# EAGLE design isolation (EAGLE 9.6.2)
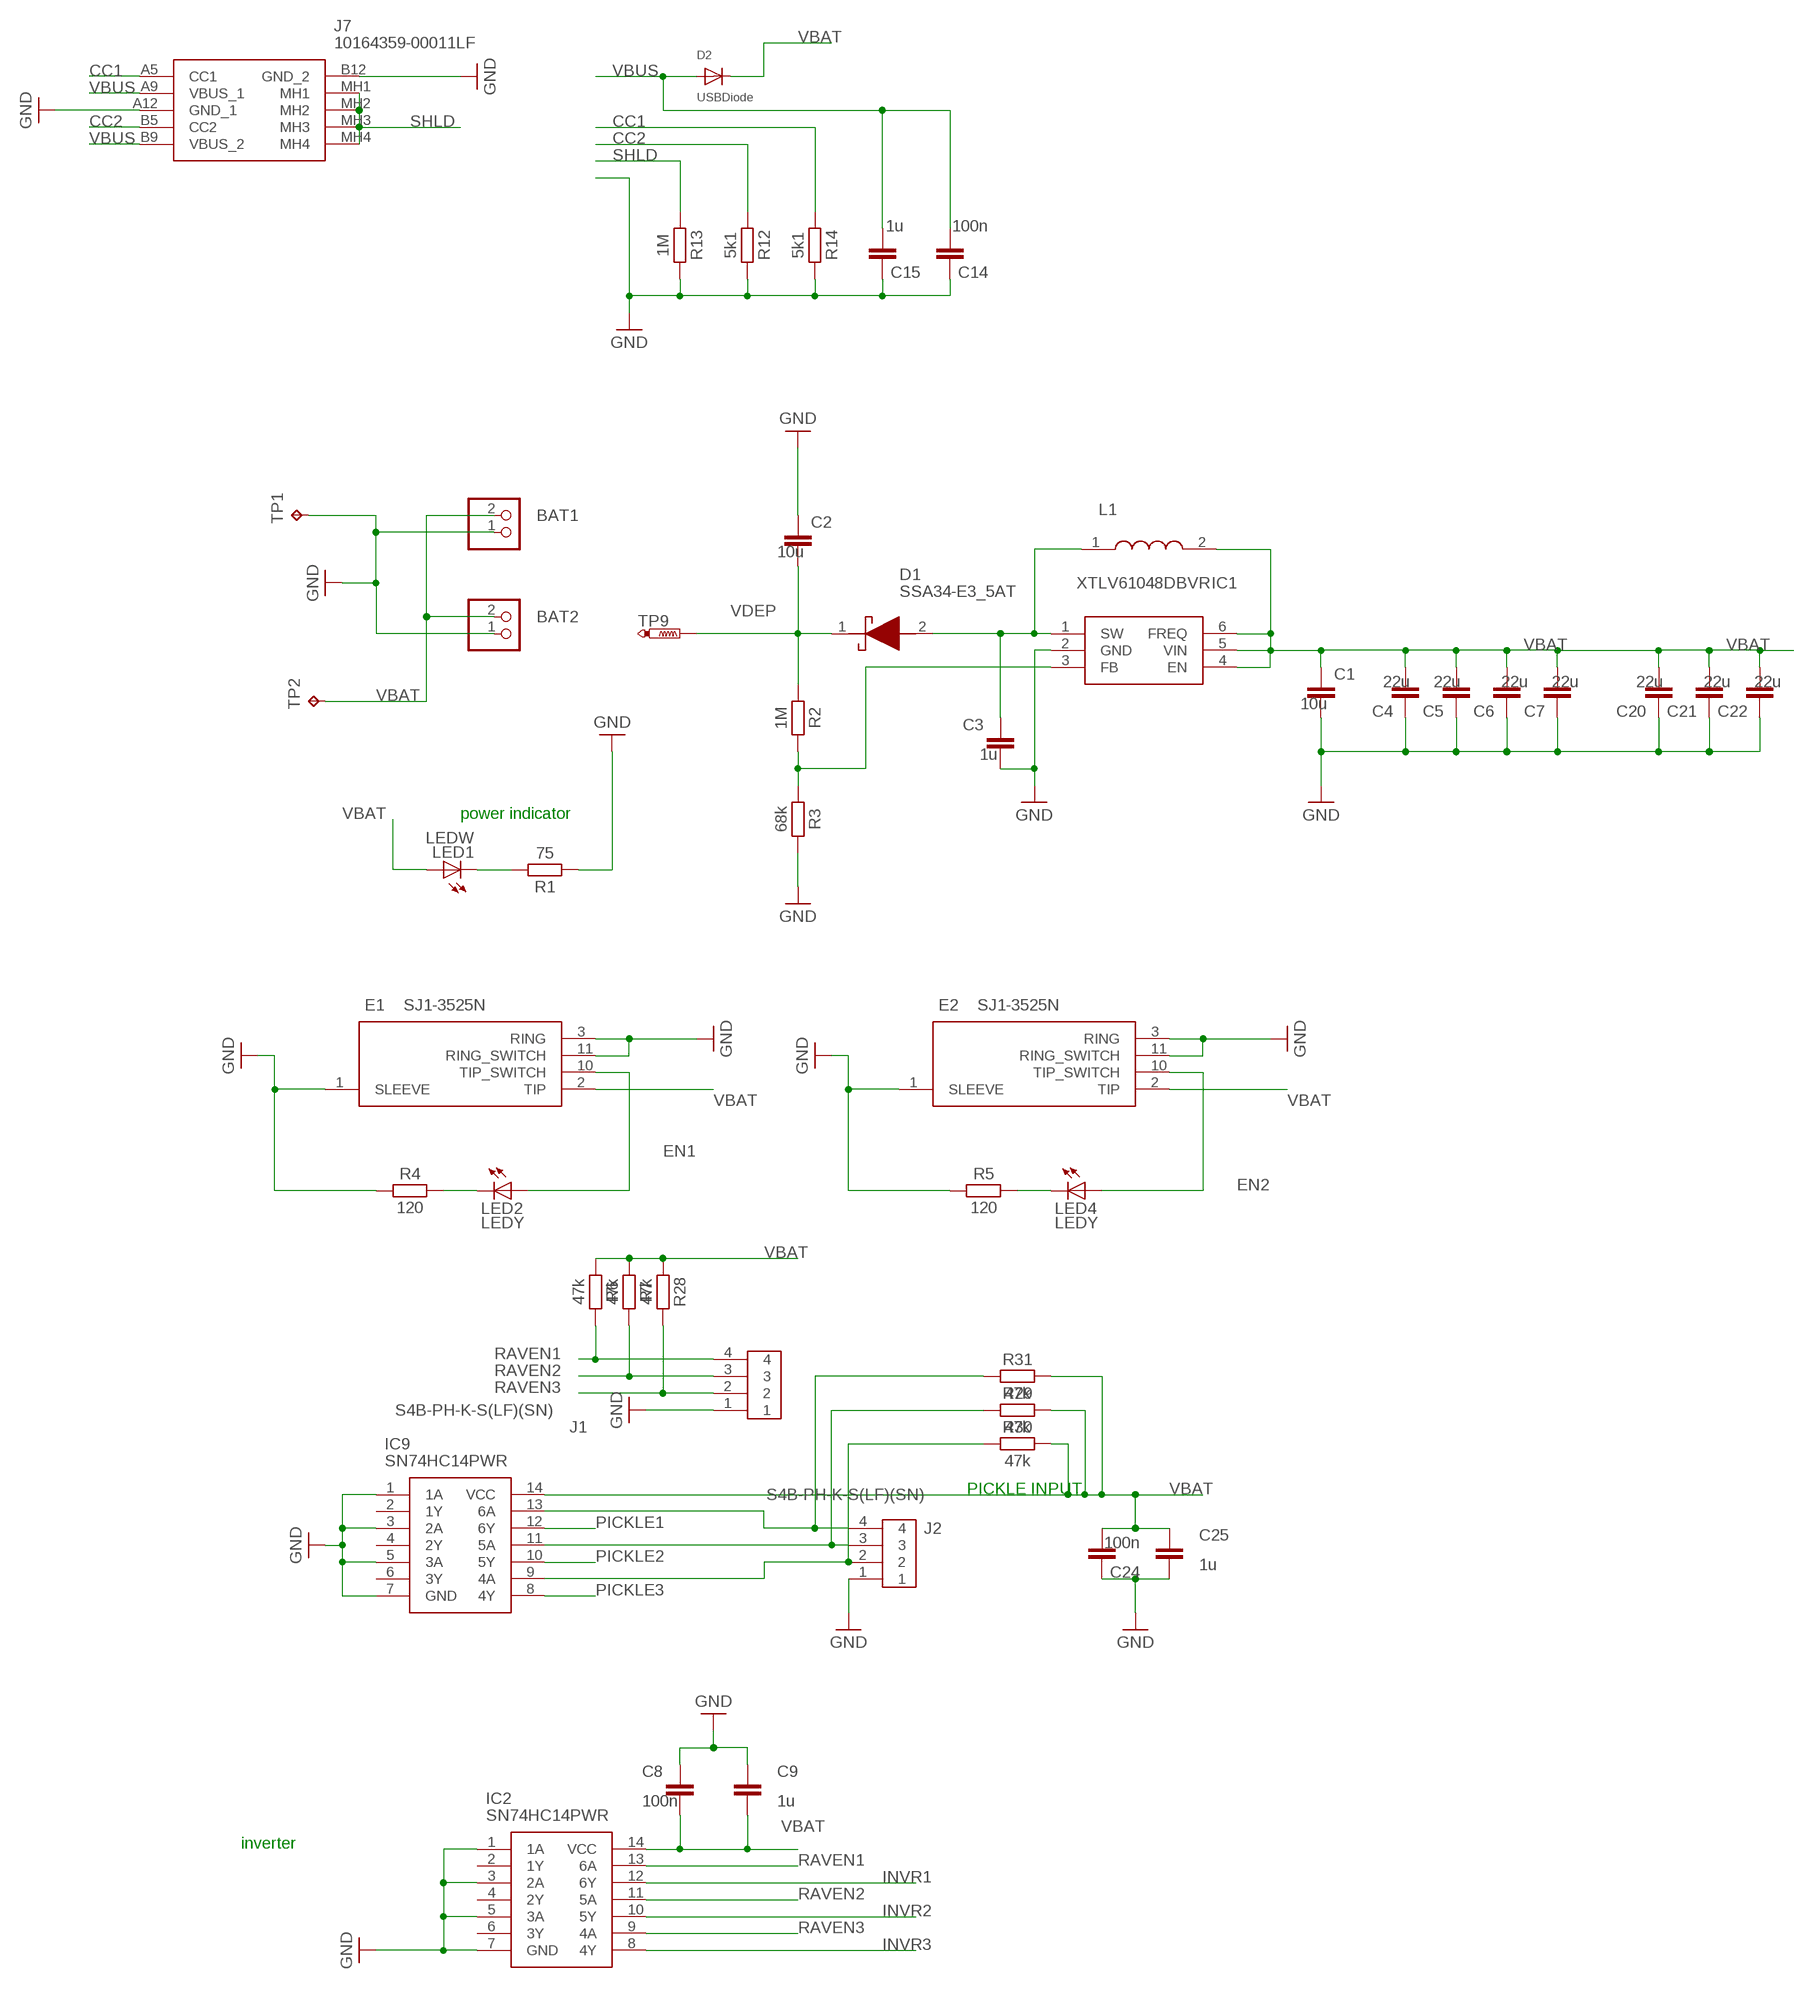
[diagram p0: schematic, sheet 1, part 1 of 2]
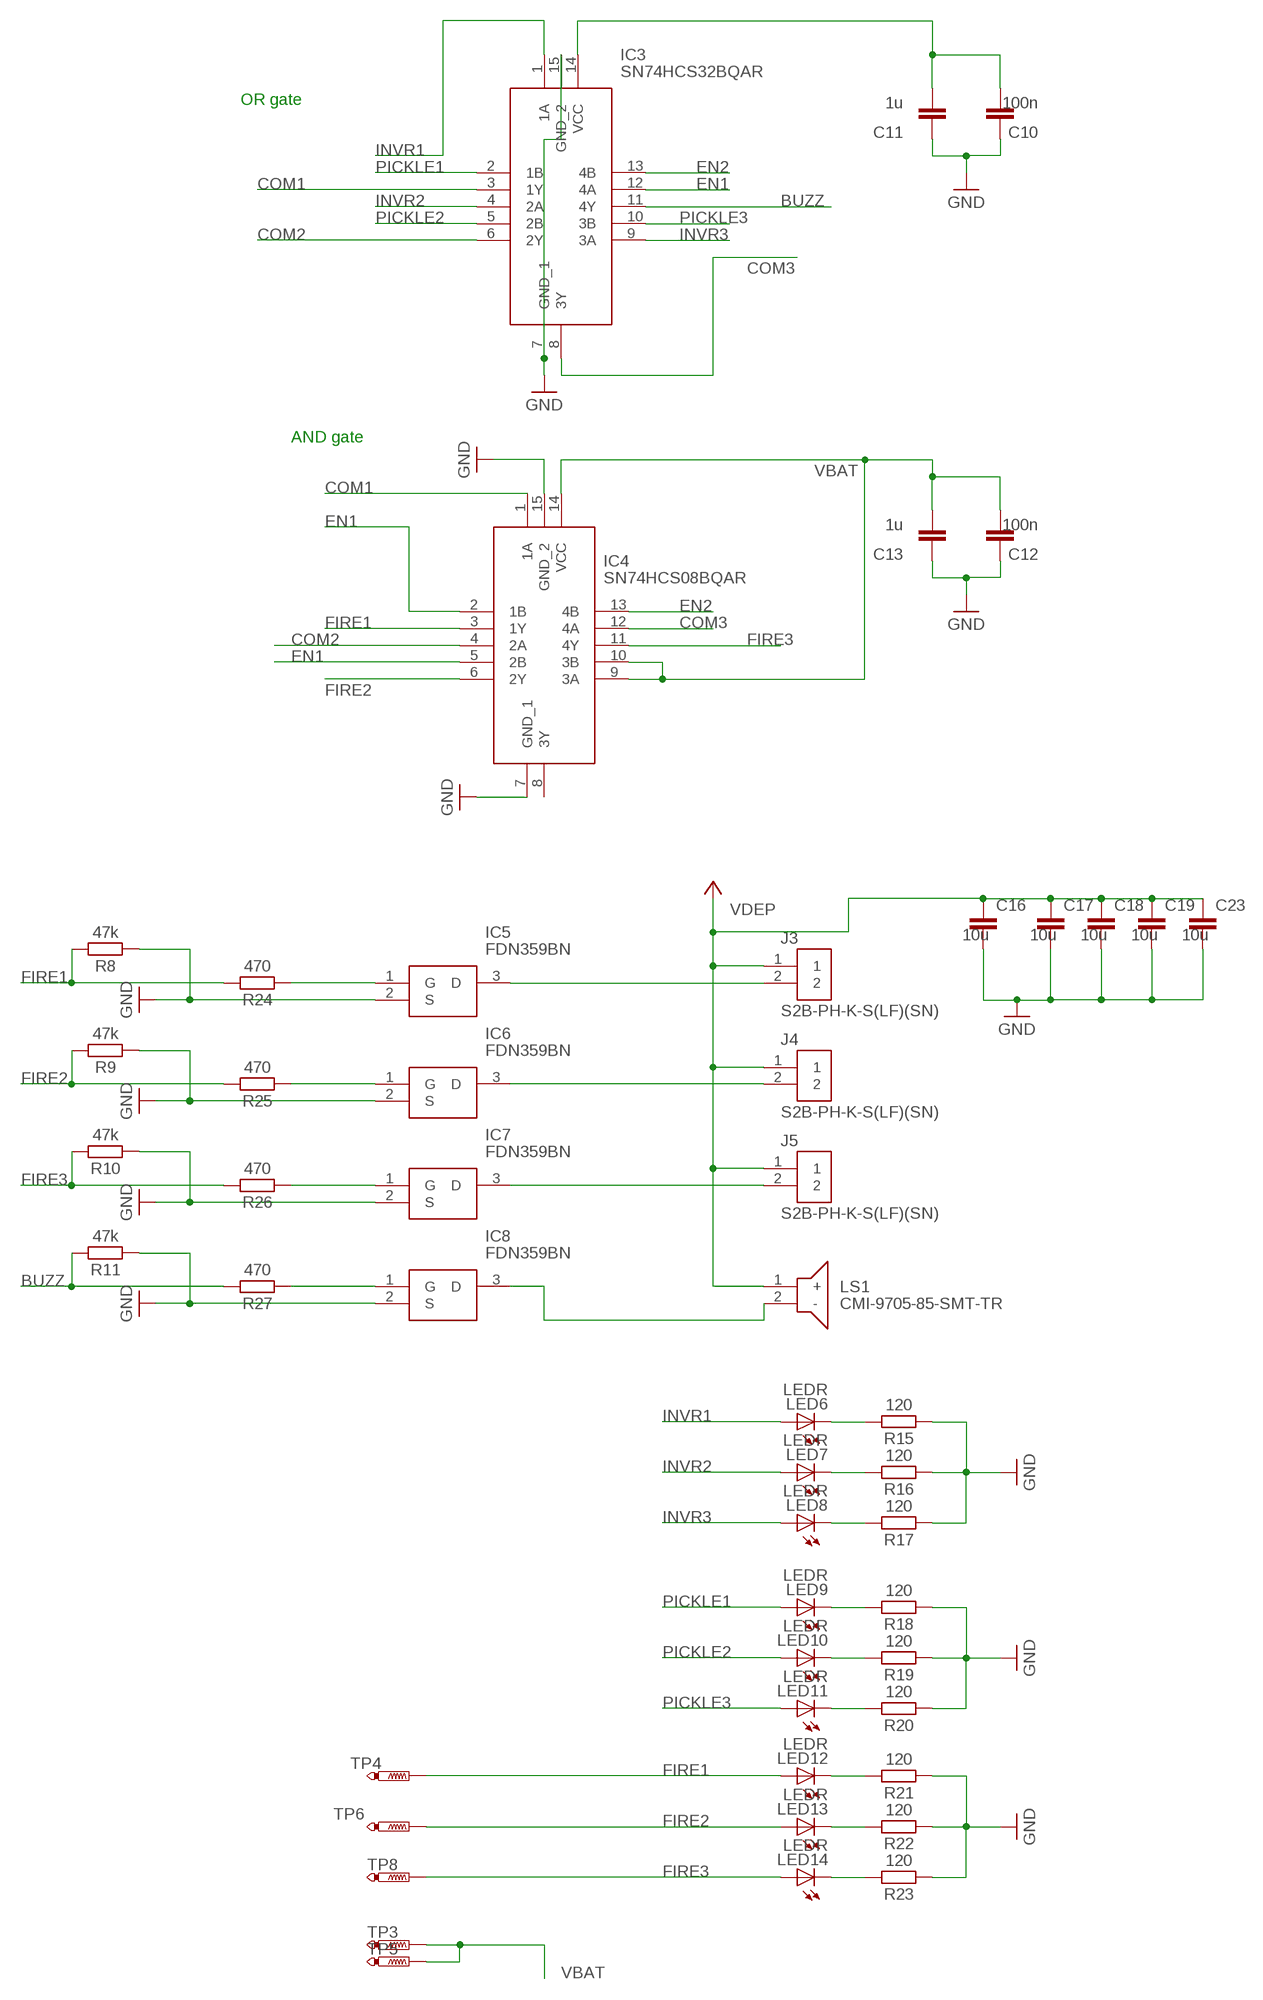
[diagram p1: schematic, sheet 1, part 2 of 2]

## Parts
BAT1  JST_2PIN-THM-RA  [JST-PH-2-THM-RA]
BAT2  JST_2PIN-THM-RA  [JST-PH-2-THM-RA]
C1  10u  C_CHIP-0402(1005-METRIC)  [CAPC1005X60]
C2  10u  C_CHIP-0603(1608-METRIC)  [CAPC1608X85]
C3  1u  C_CHIP-0402(1005-METRIC)  [CAPC1005X60]
C4  22u  C_CHIP-0603(1608-METRIC)  [CAPC1608X85]
C5  22u  C_CHIP-0603(1608-METRIC)  [CAPC1608X85]
C6  22u  C_CHIP-0603(1608-METRIC)  [CAPC1608X85]
C7  22u  C_CHIP-0603(1608-METRIC)  [CAPC1608X85]
C8  100n  C_CHIP-0402(1005-METRIC)  [CAPC1005X60]
C9  1u  C_CHIP-0402(1005-METRIC)  [CAPC1005X60]
C10  100n  C_CHIP-0402(1005-METRIC)  [CAPC1005X60]
C11  1u  C_CHIP-0402(1005-METRIC)  [CAPC1005X60]
C12  100n  C_CHIP-0402(1005-METRIC)  [CAPC1005X60]
C13  1u  C_CHIP-0402(1005-METRIC)  [CAPC1005X60]
C14  100n  C_CHIP-0402(1005-METRIC)  [CAPC1005X60]
C15  1u  C_CHIP-0402(1005-METRIC)  [CAPC1005X60]
C16  10u  C_CHIP-0603(1608-METRIC)  [CAPC1608X85]
C17  10u  C_CHIP-0603(1608-METRIC)  [CAPC1608X85]
C18  10u  C_CHIP-0603(1608-METRIC)  [CAPC1608X85]
C19  10u  C_CHIP-0603(1608-METRIC)  [CAPC1608X85]
C20  22u  C_CHIP-0603(1608-METRIC)  [CAPC1608X85]
C21  22u  C_CHIP-0603(1608-METRIC)  [CAPC1608X85]
C22  22u  C_CHIP-0603(1608-METRIC)  [CAPC1608X85]
C23  10u  C_CHIP-0603(1608-METRIC)  [CAPC1608X85]
C24  100n  C_CHIP-0402(1005-METRIC)  [CAPC1005X60]
C25  1u  C_CHIP-0402(1005-METRIC)  [CAPC1005X60]
D1  SSA34-E3_5AT  [DIOM5127X229N]
D2  USBDiode  DIODE_SOD-123FL  [SOD-123FL]
E1  SJ1-3525N  [SJ13525N]
E2  SJ1-3525N  [SJ13525N]
IC1  XTLV61048DBVR  [SOT95P280X145-6N]
IC2  SN74HC14PWR  [SOP65P640X120-14N]
IC3  SN74HCS32BQAR  [SN74HCS32BQAR]
IC4  SN74HCS08BQAR  [SN74HCS08BQAR]
IC5  FDN359BN  [SOT95P251X112-3N]
IC6  FDN359BN  [SOT95P251X112-3N]
IC7  FDN359BN  [SOT95P251X112-3N]
IC8  FDN359BN  [SOT95P251X112-3N]
IC9  SN74HC14PWR  [SOP65P640X120-14N]
J1  S4B-PH-K-S(LF)(SN)  [S4B-PH-K-S(LF)(SN)]
J2  S4B-PH-K-S(LF)(SN)  [S4B-PH-K-S(LF)(SN)]
J3  S2B-PH-K-S(LF)(SN)  [S2B-PH-K-S(LF)(SN)]
J4  S2B-PH-K-S(LF)(SN)  [S2B-PH-K-S(LF)(SN)]
J5  S2B-PH-K-S(LF)(SN)  [S2B-PH-K-S(LF)(SN)]
J7  10164359-00011LF  [1016435900011LF]
L1  10μH  BMRF00060630100MA1  [BMRF00060630100MA1]
LED1  LEDW  LEDCHIPLED_0805  [CHIPLED_0805]
LED2  LEDY  LEDCHIPLED_0805  [CHIPLED_0805]
LED4  LEDY  LEDCHIPLED_0805  [CHIPLED_0805]
LED6  LEDR  LEDCHIPLED_0805  [CHIPLED_0805]
LED7  LEDR  LEDCHIPLED_0805  [CHIPLED_0805]
LED8  LEDR  LEDCHIPLED_0805  [CHIPLED_0805]
LED9  LEDR  LEDCHIPLED_0805  [CHIPLED_0805]
LED10  LEDR  LEDCHIPLED_0805  [CHIPLED_0805]
LED11  LEDR  LEDCHIPLED_0805  [CHIPLED_0805]
LED12  LEDR  LEDCHIPLED_0805  [CHIPLED_0805]
LED13  LEDR  LEDCHIPLED_0805  [CHIPLED_0805]
LED14  LEDR  LEDCHIPLED_0805  [CHIPLED_0805]
LS1  CMI-9705-85-SMT-TR  [CMI970585SMTTR]
R1  75  R_CHIP-0603(1608-METRIC)  [RESC1608X60]
R2  1M  R_CHIP-0402(1005-METRIC)  [RESC1005X40]
R3  68k  R_CHIP-0603(1608-METRIC)  [RESC1608X60]
R4  120  R_CHIP-0402(1005-METRIC)  [RESC1005X40]
R5  120  R_CHIP-0402(1005-METRIC)  [RESC1005X40]
R6  47k  R_CHIP-0402(1005-METRIC)  [RESC1005X40]
R7  47k  R_CHIP-0402(1005-METRIC)  [RESC1005X40]
R8  47k  R_CHIP-0402(1005-METRIC)  [RESC1005X40]
R9  47k  R_CHIP-0402(1005-METRIC)  [RESC1005X40]
R10  47k  R_CHIP-0402(1005-METRIC)  [RESC1005X40]
R11  47k  R_CHIP-0402(1005-METRIC)  [RESC1005X40]
R12  5k1  R_CHIP-0402(1005-METRIC)  [RESC1005X40]
R13  1M  R_CHIP-0402(1005-METRIC)  [RESC1005X40]
R14  5k1  R_CHIP-0402(1005-METRIC)  [RESC1005X40]
R15  120  R_CHIP-0402(1005-METRIC)  [RESC1005X40]
R16  120  R_CHIP-0402(1005-METRIC)  [RESC1005X40]
R17  120  R_CHIP-0402(1005-METRIC)  [RESC1005X40]
R18  120  R_CHIP-0402(1005-METRIC)  [RESC1005X40]
R19  120  R_CHIP-0402(1005-METRIC)  [RESC1005X40]
R20  120  R_CHIP-0402(1005-METRIC)  [RESC1005X40]
R21  120  R_CHIP-0402(1005-METRIC)  [RESC1005X40]
R22  120  R_CHIP-0402(1005-METRIC)  [RESC1005X40]
R23  120  R_CHIP-0402(1005-METRIC)  [RESC1005X40]
R24  470  R_CHIP-0402(1005-METRIC)  [RESC1005X40]
R25  470  R_CHIP-0402(1005-METRIC)  [RESC1005X40]
R26  470  R_CHIP-0402(1005-METRIC)  [RESC1005X40]
R27  470  R_CHIP-0402(1005-METRIC)  [RESC1005X40]
R28  47k  R_CHIP-0402(1005-METRIC)  [RESC1005X40]
R29  47k  R_CHIP-0402(1005-METRIC)  [RESC1005X40]
R30  47k  R_CHIP-0402(1005-METRIC)  [RESC1005X40]
R31  47k  R_CHIP-0402(1005-METRIC)  [RESC1005X40]
TP1  TPPAD1-13  [P1-13]
TP2  TPPAD1-17  [P1-17]
TP3  PTR1PAD1-13  [P1-13]
TP4  PTR1PAD1-13  [P1-13]
TP5  PTR1PAD1-13  [P1-13]
TP6  PTR1PAD1-13  [P1-13]
TP8  PTR1PAD1-13  [P1-13]
TP9  PTR1PAD1-13  [P1-13]

## Nets
BUZZ: IC3.11(4Y) R11.2 R27.2
CC1: J7.A5(CC1) R14.1
CC2: J7.B5(CC2) R12.1
COM1: IC3.3(1Y) IC4.1(1A)
COM2: IC3.6(2Y) IC4.4(2A)
COM3: IC3.8(3Y) IC4.12(4A)
EN1: E1.10(TIP_SWITCH) IC3.12(4A) IC4.2(1B) IC4.5(2B) LED2.A
EN2: E2.10(TIP_SWITCH) IC3.13(4B) IC4.13(4B) LED4.A
FIRE1: IC4.3(1Y) LED12.A R8.2 R24.2 TP4.TP
FIRE2: IC4.6(2Y) LED13.A R9.2 R25.2 TP6.TP
FIRE3: IC4.11(4Y) LED14.A R10.2 R26.2 TP8.TP
GND: BAT1.1 BAT2.1 C1.2 C2.1 C3.2 C4.1 C5.1 C6.1 C7.1 C8.1 C9.1 C10.1 C11.1 C12.1 C13.1 C14.1 C15.1 C16.2 C17.2 C18.2 C19.2 C20.1 C21.1 C22.1 C23.2 C24.1 C25.2 E1.1(SLEEVE) E1.3(RING) E1.11(RING_SWITCH) E2.1(SLEEVE) E2.3(RING) E2.11(RING_SWITCH) IC1.2(GND) IC2.1(1A) IC2.3(2A) IC2.5(3A) IC2.7(GND) IC3.7(GND_1) IC3.15(GND_2) IC4.7(GND_1) IC4.15(GND_2) IC5.2(S) IC6.2(S) IC7.2(S) IC8.2(S) IC9.1(1A) IC9.3(2A) IC9.5(3A) IC9.7(GND) J1.1 J2.1 J7.A12(GND_1) J7.B12(GND_2) R1.1 R3.2 R4.1 R5.1 R8.1 R9.1 R10.1 R11.1 R12.2 R13.2 R14.2 R15.1 R16.1 R17.1 R18.1 R19.1 R20.1 R21.1 R22.1 R23.1 TP1.TP
INVR1: IC2.12(6Y) IC3.1(1A) LED6.A
INVR2: IC2.10(5Y) IC3.4(2A) LED7.A
INVR3: IC2.8(4Y) IC3.9(3A) LED8.A
N$1: LED1.C R1.2
N$2: C3.1 D1.2(A) IC1.1(SW) L1.1
N$3: IC1.3(FB) R2.2 R3.1
N$4: LED4.C R5.2
N$5: LED2.C R4.2
N$8: LED9.C R18.2
N$9: LED10.C R19.2
N$10: LED11.C R20.2
N$11: LED12.C R21.2
N$12: LED13.C R22.2
N$13: LED14.C R23.2
N$14: IC7.3(D) J5.2
N$15: IC6.3(D) J4.2
N$16: IC9.13(6A) J2.4 R31.1
N$17: IC5.3(D) J3.2
N$18: LED7.C R16.2
N$19: IC9.11(5A) J2.3 R29.1
N$20: IC5.1(G) R24.1
N$21: IC6.1(G) R25.1
N$22: IC8.3(D) LS1.2(-)
N$23: LED8.C R17.2
N$24: IC7.1(G) R26.1
N$25: IC8.1(G) R27.1
N$26: IC9.9(4A) J2.2 R30.1
N$27: LED6.C R15.2
PICKLE1: IC3.2(1B) IC9.12(6Y) LED9.A
PICKLE2: IC3.5(2B) IC9.10(5Y) LED10.A
PICKLE3: IC3.10(3B) IC9.8(4Y) LED11.A
RAVEN1: IC2.13(6A) J1.4 R6.2
RAVEN2: IC2.11(5A) J1.3 R7.2
RAVEN3: IC2.9(4A) J1.2 R28.2
SHLD: J7.MH1 J7.MH2 J7.MH3 J7.MH4 R13.1
VBAT: BAT1.2 BAT2.2 C1.1 C4.2 C5.2 C6.2 C7.2 C8.2 C9.2 C10.2 C11.2 C12.2 C13.2 C20.2 C21.2 C22.2 C24.2 C25.1 D2.C E1.2(TIP) E2.2(TIP) IC1.4(EN) IC1.5(VIN) IC1.6(FREQ) IC2.14(VCC) IC3.14(VCC) IC4.9(3A) IC4.10(3B) IC4.14(VCC) IC9.14(VCC) L1.2 LED1.A R6.1 R7.1 R28.1 R29.2 R30.2 R31.2 TP2.TP TP3.TP TP5.TP
VBUS: C14.2 C15.2 D2.A J7.A9(VBUS_1) J7.B9(VBUS_2)
VDEP: C2.2 C16.1 C17.1 C18.1 C19.1 C23.1 D1.1(K) J3.1 J4.1 J5.1 LS1.1(+) R2.1 TP9.TP ; supply symbol labelled VCC
Unconnected: IC2.2(1Y) IC2.4(2Y) IC2.6(3Y) IC4.8(3Y) IC9.2(1Y) IC9.4(2Y) IC9.6(3Y)

## Notes on the sheet
- power indicator
- PICKLE INPUT
- inverter
- OR gate
- AND gate

## Library data of the parts
BAT1 BAT2 = adafruit:JST_2PIN: JST 2-Pin Connectors of various flavors SMT-RA (S2B-PH-SM4) 4UConnector #17311 SMT (B2B-PH-SM4) THM-RA (S2B-PH) THM (B2B-PH)
C1-C25 = Capacitor:C: Capacitor - Generic; CATEGORY: Capacitor
D1 = SamacSys_Parts:SSA34-E3_5AT: Vishay SSA34-E3/5AT, SMT Schottky Diode, 40V 3A, 2-Pin DO-214AC Source: Datasheet <https://www.vishay.com/docs/88883/ssa33l.pdf>; ARROW_PART_NUMBER: SSA34-E3/5AT; ARROW_PRICE-STOCK: https://www.arrow.com/en/products/ssa34-e35at/vishay?region=nac; DESCRIPTION: Vishay SSA34-E3/5AT, SMT Schottky Diode, 40V 3A, 2-Pin DO-214AC; HEIGHT: 2.29mm; MANUFACTURER_NAME: Vishay; MANUFACTURER_PART_NUMBER: SSA34-E3/5AT; MOUSER_PART_NUMBER: 625-SSA34-E3/5AT; MOUSER_PRICE-STOCK: https://www.mouser.co.uk/ProductDetail/Vishay-General-Semiconductor/SSA34-E3-5AT?qs=x2jpVgRnAtMCobuyGDc8VQ%3D%3D
D2 = adafruit:DIODE: Diode SMADIODE - SMA Surface Mount Package 20V 1A Schottky Diode Digikey: 641-1014-6-ND DO-1N4148 - Through Hole Small Current Diode SOD-123 20V 1 A (.5mV Vf) Schottky Diode - Digikey: MBRX120TPMSCT-ND SOD-323 10V 570mA (.38mV Vf, 3ns) Schottky Diode - Digikey: ZLLS410CT-ND SOD-523 30V 30mA Schottky Diode (RB751S-40TE61) - Digikey: RB751S-40TE61CT-ND SOT23-R/W - SOT23 Package (R = Solder Paste/Reflow Ovens, W = Hand-Soldering) BAT54Film 40V 300mA - Digikey: 497-7162-1-ND
E1 E2 = SamacSys_Parts:SJ1-3525N: 3.5 mm, Stereo, Right Angle, Through Hole, 3 Conductors, 2 Internal Switches, Audio Jack Connector Source: Datasheet <https://www.cuidevices.com/product/resource/pdf/sj1-352xn.pdf>; DESCRIPTION: 3.5 mm, Stereo, Right Angle, Through Hole, 3 Conductors, 2 Internal Switches, Audio Jack Connector; HEIGHT: mm; MANUFACTURER_NAME: CUI Devices; MANUFACTURER_PART_NUMBER: SJ1-3525N
IC1 = SamacSys_Parts:XTLV61048DBVR: 15-V output voltage non-synchronous boost converter in SOT-23 package Source: Datasheet <https://pdf1.alldatasheet.com/datasheet-pdf/view/1134744/TI1/XTLV61048DBVR.html>; DESCRIPTION: 15-V output voltage non-synchronous boost converter in SOT-23 package; HEIGHT: 1.45mm; MANUFACTURER_NAME: Texas Instruments; MANUFACTURER_PART_NUMBER: XTLV61048DBVR; MOUSER_PART_NUMBER: N/A; MOUSER_PRICE-STOCK: https://www.mouser.com/Search/Refine.aspx?Keyword=N%2FA
IC2 IC9 = SamacSys_Parts:SN74HC14PWR: Hex Schmitt-Trigger Inverters Source: Datasheet <http://www.ti.com/general/docs/suppproductinfo.tsp?distId=10&gotoUrl=http://www.ti.com/lit/gpn/sn74hc14>; ARROW_PART_NUMBER: SN74HC14PWR; ARROW_PRICE-STOCK: https://www.arrow.com/en/products/sn74hc14pwr/texas-instruments?region=nac; DESCRIPTION: Hex Schmitt-Trigger Inverters; HEIGHT: 1.2mm; MANUFACTURER_NAME: Texas Instruments; MANUFACTURER_PART_NUMBER: SN74HC14PWR; MOUSER_PART_NUMBER: 595-SN74HC14PWR; MOUSER_PRICE-STOCK: https://www.mouser.co.uk/ProductDetail/Texas-Instruments/SN74HC14PWR?qs=YEaxc5757jODQ8PDizZzPA%3D%3D
IC3 = SamacSys_Parts:SN74HCS32BQAR: OR Gate IC 4 Channel Schmitt Trigger Input 14-WQFN (3x2.5) Source: Datasheet <https://www.ti.com/lit/ds/symlink/sn74hcs32.pdf?HQS=dis-dk-null-digikeymode-dsf-pf-null-wwe&ts=1662965858765>; ARROW_PART_NUMBER: SN74HCS32BQAR; ARROW_PRICE-STOCK: https://www.arrow.com/en/products/sn74hcs32bqar/texas-instruments?region=nac; DESCRIPTION: OR Gate IC 4 Channel Schmitt Trigger Input 14-WQFN (3x2.5); HEIGHT: 0.8mm; MANUFACTURER_NAME: Texas Instruments; MANUFACTURER_PART_NUMBER: SN74HCS32BQAR; MOUSER_PART_NUMBER: 595-SN74HCS32BQAR; MOUSER_PRICE-STOCK: https://www.mouser.co.uk/ProductDetail/Texas-Instruments/SN74HCS32BQAR?qs=stqOd1AaK78oD0q8sZ5E5Q%3D%3D
IC4 = SamacSys_Parts:SN74HCS08BQAR: Logic Gates 4-ch, 2-input, 2-V to 6-V low power AND gates with Schmitt-Trigger inputs 14-WQFN -40 to 125 Source: Datasheet <https://www.ti.com/lit/ds/symlink/sn74hcs08.pdf?HQS=dis-mous-null-mousermode-dsf-pf-null-wwe&ts=1663735547616&ref_url=https%3A%2F%2Fwww.mouser.com%2F>; ARROW_PART_NUMBER: SN74HCS08BQAR; ARROW_PRICE-STOCK: https://www.arrow.com/en/products/sn74hcs08bqar/texas-instruments?region=nac; DESCRIPTION: Logic Gates 4-ch, 2-input, 2-V to 6-V low power AND gates with Schmitt-Trigger inputs 14-WQFN -40 to 125; HEIGHT: 0.8mm; MANUFACTURER_NAME: Texas Instruments; MANUFACTURER_PART_NUMBER: SN74HCS08BQAR; MOUSER_PART_NUMBER: 595-SN74HCS08BQAR; MOUSER_PRICE-STOCK: https://www.mouser.co.uk/ProductDetail/Texas-Instruments/SN74HCS08BQAR?qs=stqOd1AaK78YU94khf0tnw%3D%3D
IC5-IC8 = SamacSys_Parts:FDN359BN: FDN359BN, N-channel MOSFET Transistor 2.7 A 30 V, 3-Pin SuperSOT Source: Datasheet <https://www.onsemi.com/pub/Collateral/FDN359BN-D.pdf>; ARROW_PART_NUMBER: FDN359BN; ARROW_PRICE-STOCK: https://www.arrow.com/en/products/fdn359bn/on-semiconductor?region=nac; DESCRIPTION: FDN359BN, N-channel MOSFET Transistor 2.7 A 30 V, 3-Pin SuperSOT; HEIGHT: 1.12mm; MANUFACTURER_NAME: onsemi; MANUFACTURER_PART_NUMBER: FDN359BN; MOUSER_PART_NUMBER: 512-FDN359BN; MOUSER_PRICE-STOCK: https://www.mouser.co.uk/ProductDetail/ON-Semiconductor-Fairchild/FDN359BN?qs=8YYpzd7qSxKZfze3Gm99uA%3D%3D
J1 J2 = Headers:S4B-PH-K-S(LF)(SN): CONN HEADER R/A 4POS 2MM Manufacturer's datasheet <http://www.jst-mfg.com/product/pdf/eng/ePH.pdf>; CREATED_BY: PCBLayout.com; DIGIKEY_PARTNO: 455-1721-ND; MANUFACTURER: JST Sales America Inc.; MPN: S4B-PH-K-S(LF)(SN)
J3-J5 = Connectors:S2B-PH-K-S(LF)(SN): CONN HEADER R/A 2POS 2MM Manufacturer's datasheet <http://www.jst-mfg.com/product/pdf/eng/ePH.pdf>; CREATED_BY: PCBLayout.com; DIGI_KEY_PART_NUMBER: 455-1719-ND; MANUFACTURER: JST Sales America Inc.; MPN: S2B-PH-K-S(LF)(SN)
J7 = SamacSys_Parts:10164359-00011LF: USB Type C Receptacle SMT Single Row 6Pin Source: Datasheet <https://cdn.amphenol-cs.com/media/wysiwyg/files/drawing/10164359.pdf>; ARROW_PART_NUMBER: 10164359-00011LF; ARROW_PRICE-STOCK: https://www.arrow.com/en/products/10164359-00011lf/amphenol-fci?region=nac; DESCRIPTION: USB Type C Receptacle SMT Single Row 6Pin; HEIGHT: 3.41mm; MANUFACTURER_NAME: Amphenol; MANUFACTURER_PART_NUMBER: 10164359-00011LF; MOUSER_PART_NUMBER: 649-10164359-00011LF; MOUSER_PRICE-STOCK: https://www.mouser.co.uk/ProductDetail/Amphenol-FCI/10164359-00011LF?qs=MyNHzdoqoQLpQ%2FmSqA1%252BtQ%3D%3D
L1 = SamacSys_Parts:BMRF00060630100MA1: 10 H Shielded Molded Inductor 4 A 68mOhm Max Nonstandard Source: Datasheet <https://www.chilisin.com/upload/media/product/power/file/BMRx_Series.pdf>; DESCRIPTION: 10 H Shielded Molded Inductor 4 A 68mOhm Max Nonstandard; HEIGHT: 3mm; MANUFACTURER_NAME: Chilisin; MANUFACTURER_PART_NUMBER: BMRF00060630100MA1
LED1 LED2 LED4 LED6-LED14 = adafruit:LED: LED OSRAM: - CHIPLED LG R971, LG N971, LY N971, LG Q971, LY Q971, LO R971, LY R971 LH N974, LH R974 LS Q976, LO Q976, LY Q976 LO Q996 - Hyper CHIPLED LW Q18S LB Q993, LB Q99A, LB R99A - SideLED LS A670, LO A670, LY A670, LG A670, LP A670 LB A673, LV A673, LT A673, LW A673 LH A674 LY A675 LS A676, LA A676, LO A676, LY A676, LW A676 LS A679, LY A679, LG A679 - Hyper Micro SIDELED® LS Y876, LA Y876, LO Y876, LY Y876 LT Y87S - SmartLED LW L88C, LW L88S LB L89C, LB L89S, LG L890 LS L89K, LO L89K, LY L89K LS L896, LA L896, LO L896, LY L896 - TOPLED LS T670, LO T670, LY T670, LG T670, LP T670 LSG T670, LSP T670, LSY T670, LOP T670, LYG T670 LG T671, LOG T671, LSG T671 LB T673, LV T673, LT T673, LW T673 LH T674 LS T676, LA T676, LO T676, LY T676, LB T676, LH T676, LSB T676, LW T676 LB T67C, LV T67C, LT T67C, LS T67K, LO T67K, LY T67K, LW E67C LS E67B, LA E67B, LO E67B, LY E67B, LB E67C, LV E67C, LT E67C LW T67C LS T679, LY T679, LG T679 LS T770, LO T770, LY T770, LG T770, LP T770 LB T773, LV T773, LT T773, LW T773 LH T774 LS E675, LA E675, LY E675, LS T675 LS T776, LA T776, LO T776, LY T776, LB T776 LHGB T686 LT T68C, LB T68C - Hyper Mini TOPLED® LB M676 - Mini TOPLED Santana® LG M470 LS M47K, LO M47K, LY M47K Source: http://www.osram.convergy.de/
LS1 = SamacSys_Parts:CMI-9705-85-SMT-TR: Piezo Buzzers & Audio Indicators buzzer, 9.7 mm x 9.7 mm x 5 mm deep, M, 12 VDC, 85 dB, Surface Mount, Audio Indicator Source: Datasheet <https://www.mouser.com/datasheet/2/670/cmi-9705-85-smt-tr-1627760.pdf>; ARROW_PART_NUMBER: CMI-9705-85-SMT-TR; ARROW_PRICE-STOCK: https://www.arrow.com/en/products/cmi-9705-85-smt-tr/cui-devices?region=nac; DESCRIPTION: Piezo Buzzers & Audio Indicators buzzer, 9.7 mm x 9.7 mm x 5 mm deep, M, 12 VDC, 85 dB, Surface Mount, Audio Indicator; HEIGHT: 5.5mm; MANUFACTURER_NAME: CUI Devices; MANUFACTURER_PART_NUMBER: CMI-9705-85-SMT-TR; MOUSER_PART_NUMBER: 490-CMI-9705-85SMTTR; MOUSER_PRICE-STOCK: https://www.mouser.co.uk/ProductDetail/CUI-Devices/CMI-9705-85-SMT-TR?qs=P1JMDcb91o4Wun0lW9vptg%3D%3D
R1-R31 = Resistor:R: Resistor Fixed - Generic; CATEGORY: Resistor; SUB-CATEGORY: Fixed
TP1 TP2 = testpad:TP: Test pad
TP3-TP6 TP8 TP9 = testpad:PTR1: TEST PIN

## Board
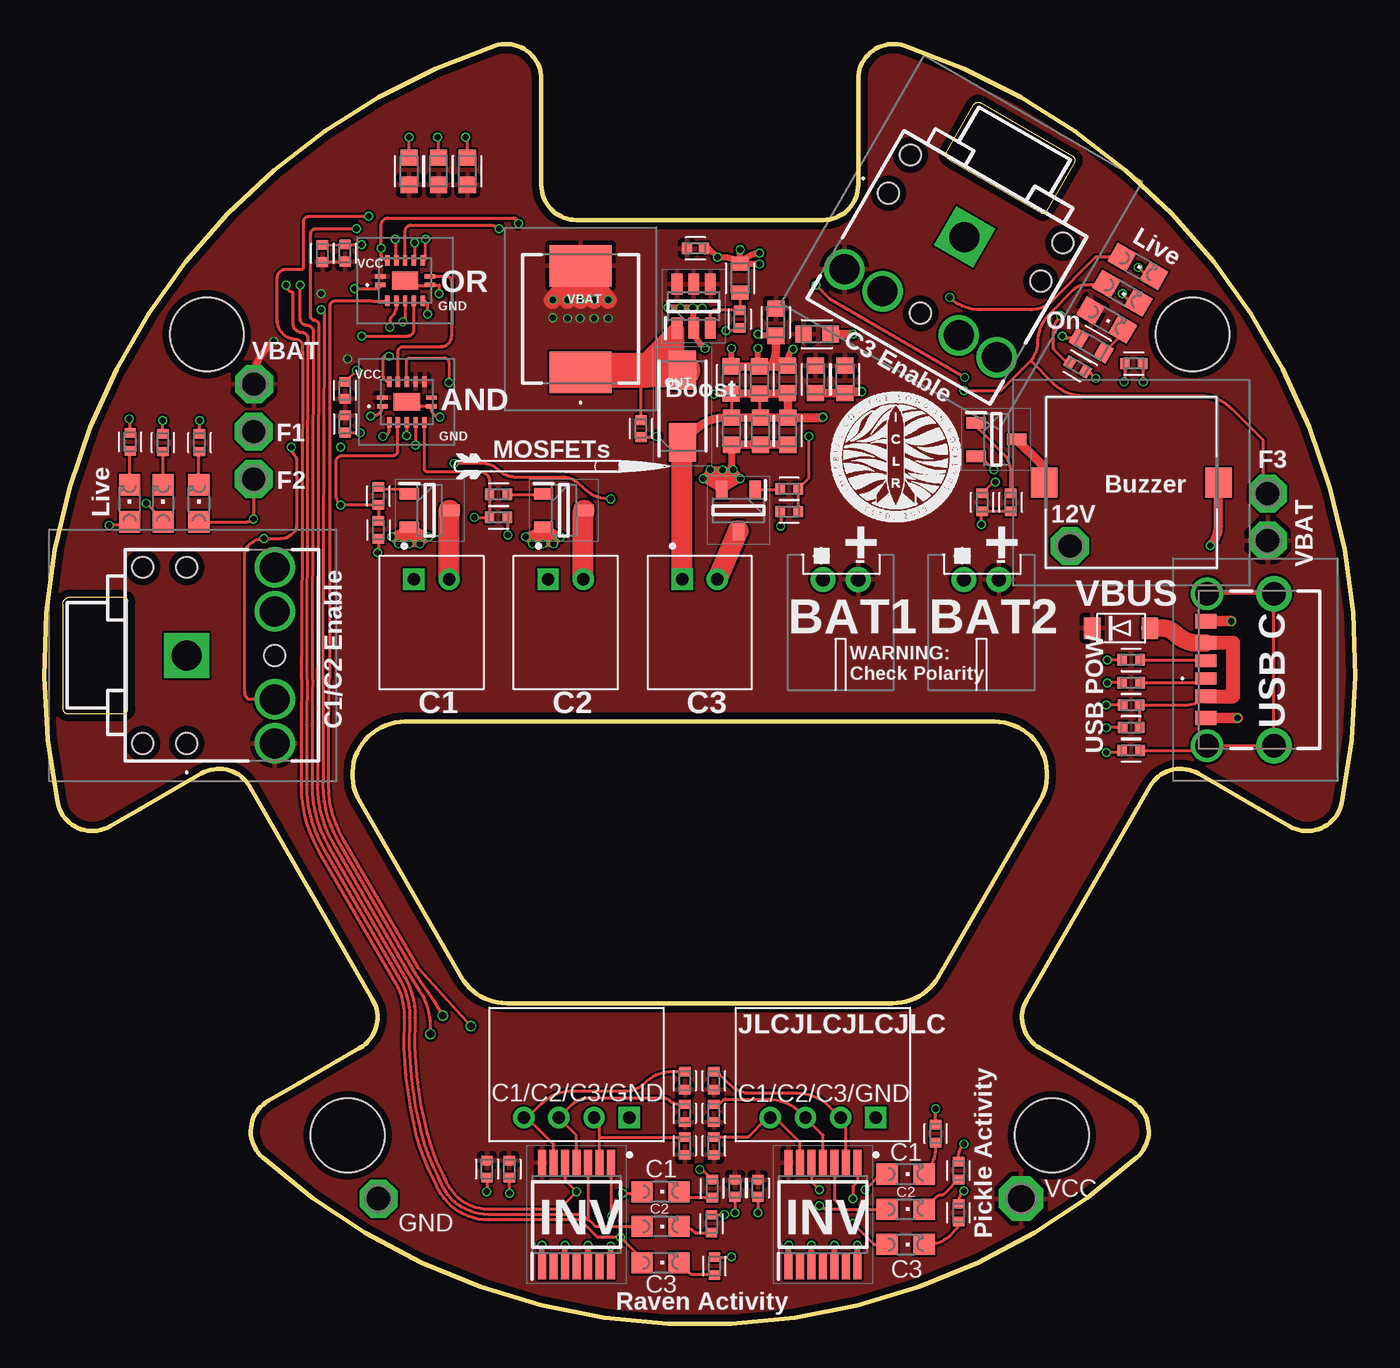
[diagram p2: board, top side]
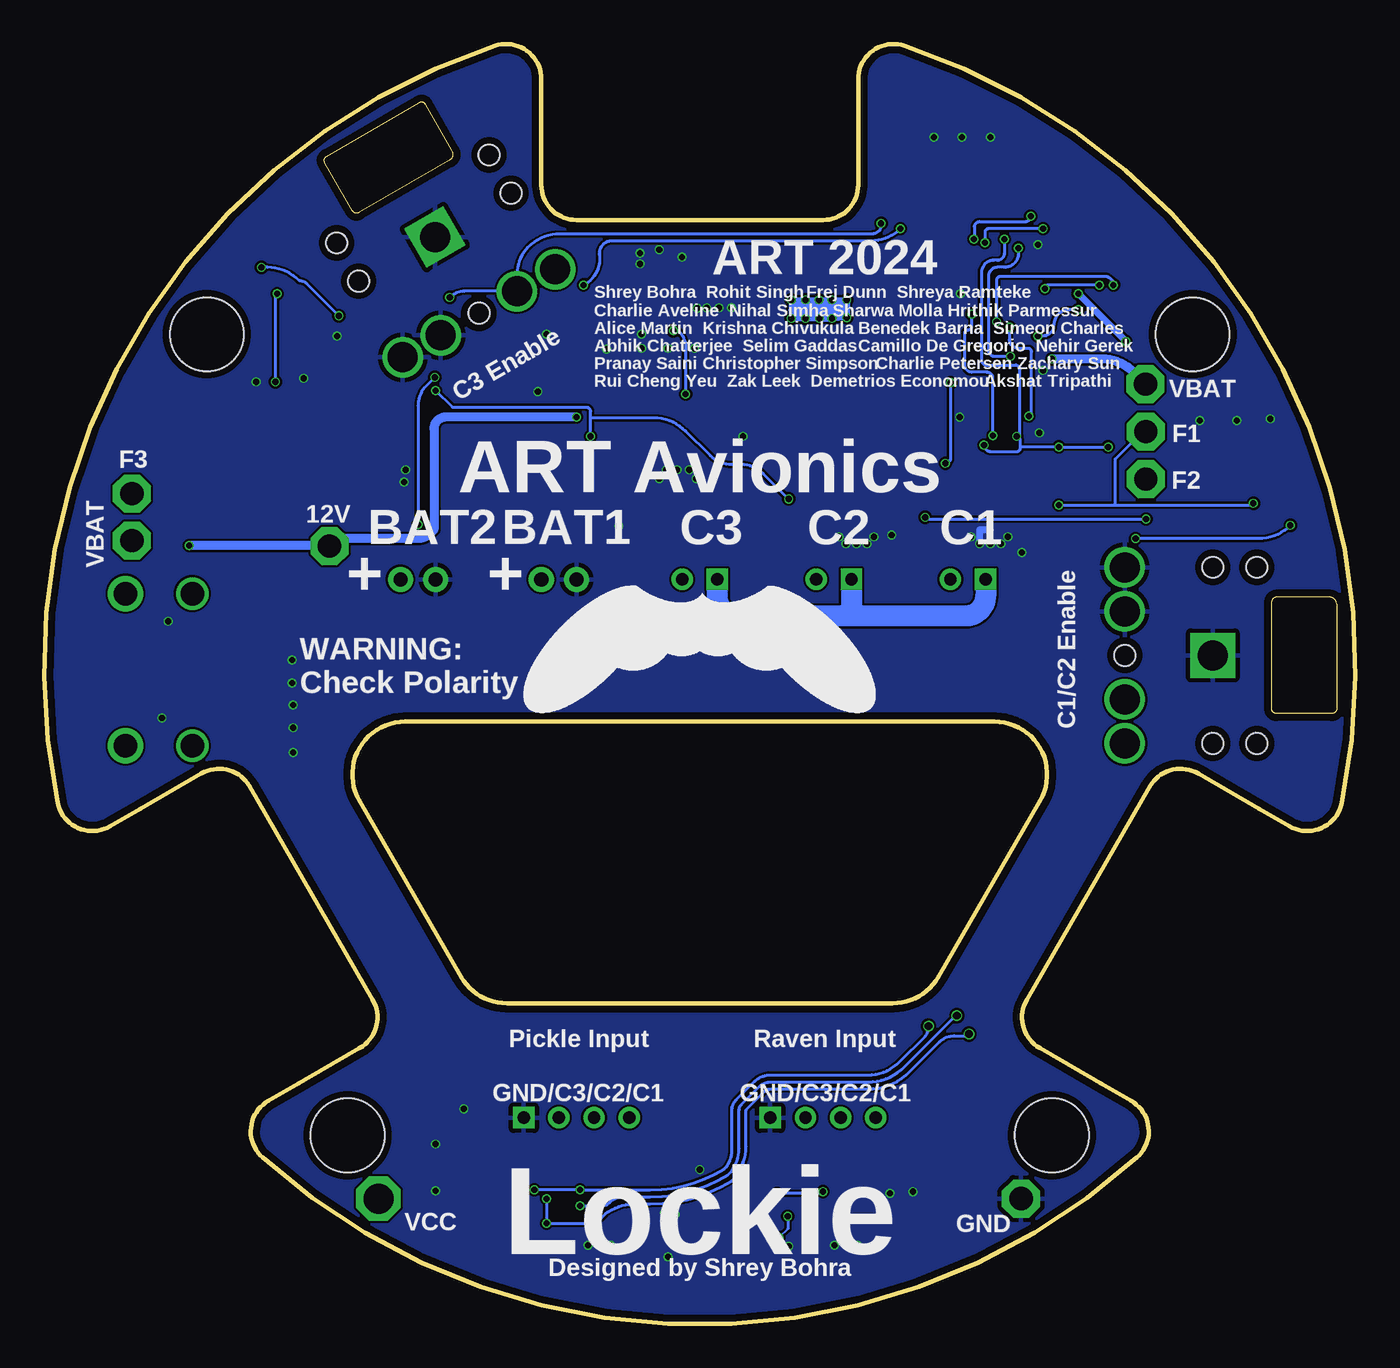
[diagram p3: board, bottom side, seen from below]

Size 74.49 x 72.69 mm. Coordinates in mm from the lower left corner, seen from the top.
Outline: 5.48,29.25 8.94,31.25 arc-90 11.67,30.52 18.67,18.4 arc-90 17.94,15.67 14.48,13.67 12.74,12.67 arc108 12.41,9.44 arc84 62.08,9.44 arc108 61.75,12.67 60.02,13.67 56.55,15.67 arc-90 55.82,18.4 62.82,30.52 arc-90 65.55,31.25 69.02,29.25 70.75,28.25 arc108 73.71,29.58 arc84 48.87,72.6 arc108 46.25,70.7 46.25,64.7 arc-90 44.25,62.7 30.25,62.7 arc-90 28.25,64.7 28.25,70.7 arc108 25.62,72.6 arc84 0.79,29.58 arc108 3.74,28.25 5.48,29.25
Outline: 20.52,34.21 53.98,34.21 arc-120 56.58,29.71 50.8,19.71 arc-60 48.21,18.21 26.29,18.21 arc-60 23.69,19.71 17.92,29.71 arc-120 20.52,34.21
Outline: 1.07,40.89 1.07,34.92 arc90 1.33,34.67 4.5,34.67 arc90 4.75,34.92 4.75,41.02 arc90 4.5,41.27 1.45,41.27 arc90 1.07,40.89
Outline: 51.44,66.1 56.61,63.12 arc90 56.96,63.21 58.55,65.96 arc90 58.46,66.31 53.18,69.35 arc90 52.83,69.26 51.31,66.62 arc90 51.44,66.1
Copper layers (1*16): Top 0.035mm / dielectric 1.6mm / Bottom 0.035mm
Design rules "jlcpcb-2layers *": minimum track width 5mil, minimum drill 0.3mm, track to track 5mil, track to pad 5mil, pad to pad 5mil, via to via 5mil, smd to smd 5mil, copper to edge 0.4mm, drill to drill 6mil, minimum pad ring 10mil, minimum via ring 3mil, stop-mask expansion 4mil, vias tented up to drill 0.4mm, thermal gap 10mil
Holes 4.2 mm at 17.25,10.71 57.25,10.71 65.25,56.21 9.25,56.21

### Footprints (pad centres in the part's own frame; a part is rotated, then mirrored left to right if it is on the bottom)
JST-PH-2-THM-RA = drill 0.8 pad 1.422: 1 1,0; 2 -1,0
CAPC1005X60 = smd 0.56 x 0.629: 1 -0.485,0; 2 0.485,0
CAPC1608X85 = smd 0.921 x 0.97: 1 -0.775,0; 2 0.775,0
DIOM5127X229N = smd 2.2 x 1.55: 1 -2.05,0; 2 2.05,0
SOD-123FL = smd 0.91 x 1.22: A 1.637,0; C -1.637,0
SJ13525N = drill 1.7 pad 2.55 square: 1 0,0 | drill 1.7 pad 2.3: 2 -5,-5; 3 5,-5; 10 -2.5,-5; 11 2.5,-5 | hole 1.2: -5,2.5; -5,0; 0,-5; 5,0; 5,2.5
SOT95P280X145-6N = smd 1.2 x 0.6: 1 -1.25,0.95; 2 -1.25,0; 3 -1.25,-0.95; 4 1.25,-0.95; 5 1.25,0; 6 1.25,0.95
SOP65P640X120-14N = smd 1.475 x 0.45: 1 -2.938,1.95; 2 -2.938,1.3; 3 -2.938,0.65; 4 -2.938,0; 5 -2.938,-0.65; 6 -2.938,-1.3; 7 -2.938,-1.95; 8 2.938,-1.95; 9 2.938,-1.3; 10 2.938,-0.65; 11 2.938,0; 12 2.938,0.65; 13 2.938,1.3; 14 2.938,1.95
SN74HCS32BQAR = smd 0.25 x 0.6: 1 -0.25,1.4; 7 -0.25,-1.4; 8 0.25,-1.4; 14 0.25,1.4 | smd 0.6 x 0.25: 2 -1.15,1; 3 -1.15,0.5; 4 -1.15,0; 5 -1.15,-0.5; 6 -1.15,-1; 9 1.15,-1; 10 1.15,-0.5; 11 1.15,0; 12 1.15,0.5; 13 1.15,1 | smd 1 x 1.5: 15 0,0
SN74HCS08BQAR = smd 0.25 x 0.6: 1 -0.25,1.4; 7 -0.25,-1.4; 8 0.25,-1.4; 14 0.25,1.4 | smd 0.6 x 0.25: 2 -1.15,1; 3 -1.15,0.5; 4 -1.15,0; 5 -1.15,-0.5; 6 -1.15,-1; 9 1.15,-1; 10 1.15,-0.5; 11 1.15,0; 12 1.15,0.5; 13 1.15,1 | smd 1 x 1.5: 15 0,0
SOT95P251X112-3N = smd 1.1 x 0.65: 1 -1.15,0.95; 2 -1.15,-0.95; 3 1.15,0
S4B-PH-K-S(LF)(SN) = drill 0.7 square: 1 -3,0 | drill 0.7: 2 -1,0; 3 1,0; 4 3,0
S2B-PH-K-S(LF)(SN) = drill 0.7 square: 1 -1,0 | drill 0.7: 2 1,0
1016435900011LF = smd 0.7 x 1.2: A5 -0.5,3.03; B5 0.5,3.03 | smd 0.76 x 1.2: A9 1.52,3.03; B9 -1.52,3.03 | smd 0.8 x 1.2: A12 2.75,3.03; B12 -2.75,3.03 | drill 1.34 pad 1.85: MH1 -4.32,2.95; MH2 4.32,2.95 | drill 1.34 pad 2.01: MH3 -4.32,-0.85; MH4 4.32,-0.85
BMRF00060630100MA1 = smd 2.35 x 3.5: 1 -3.025,0; 2 3.025,0
CHIPLED_0805 = smd 1.2 x 1.2: A 0,-1.05; C 0,1.05
CMI970585SMTTR = smd 1.7 x 1.5: 1 0,4.95; 2 0,-4.95
RESC1608X60 = smd 0.799 x 0.974: 1 -0.815,0; 2 0.815,0
RESC1005X40 = smd 0.535 x 0.644: 1 -0.507,0; 2 0.507,0
P1-13 = drill 1.321 pad 2.159 octagon: TP 0,0
P1-17 = drill 1.702 pad 2.54 octagon: TP 0,0

### Placement (x,y rotation side)
BAT1  45.25,42.29 180 top
BAT2  53.25,42.29 180 top
C1  37.01,61.08 0 top
C2  39.03,53.61 270 top
C3  33.91,50.85 270 top
C4  20.74,65.47 270 top
C5  22.41,65.47 270 top
C6  45.49,53.65 90 top
C7  24.05,65.47 270 top
C8  26.43,8.79 90 top
C9  25.16,8.79 90 top
C10  17.1,60.82 270 top
C11  15.81,60.8 270 top
C12  17.1,51.11 90 top
C13  17.1,53.02 270 top
C14  61.75,35.14 0 top
C15  61.75,33.86 0 top
C16  40.69,50.71 270 top
C17  40.64,53.61 90 top
C18  42.25,50.71 270 top
C19  42.24,53.65 90 top
C20  43.91,56.22 180 top
C21  43.83,53.65 90 top
C22  41.57,56.89 90 top
C23  39.05,50.71 270 top
C24  40.55,7.71 90 top
C25  39.25,7.71 270 top
D1  36.27,52.12 90 top
D2  61.17,39.52 0 top
E1  8.11,37.97 90 top
E2  52.29,61.73 330 top
IC1  36.9,57.8 90 top
IC2  30.25,6.21 90 top
IC3  20.51,59.25 90 top
IC4  20.61,52.36 90 top
IC5  21.91,46.21 0 top
IC6  29.53,46.21 0 top
IC7  39.45,46.21 270 top
IC8  54.09,50.23 0 top
IC9  44.25,6.21 90 top
J1  30.25,11.71 180 top
J2  44.25,11.71 180 top
J3  22.01,42.29 0 top
J4  29.63,42.29 0 top
J5  37.25,42.29 0 top
J7  69.02,37.16 90 top
L1  30.48,57.07 90 top
LED1  60.36,57.02 240 top
LED2  4.86,46.6 0 top
LED4  62.14,60.07 240 top
LED6  35.02,7.5 270 top
LED7  35.02,5.54 270 top
LED8  35.02,3.47 270 top
LED9  48.95,8.51 270 top
LED10  48.95,6.51 270 top
LED11  48.95,4.51 270 top
LED12  6.77,46.6 0 top
LED13  8.8,46.6 0 top
LED14  61.25,58.54 240 top
LS1  61.76,47.78 270 top
R1  59.49,55.57 330 top
R2  39.52,57.07 90 top
R3  39.53,59.39 90 top
R4  4.89,50.1 270 top
R5  58.71,54.35 150 top
R6  36.4,13.81 90 top
R7  36.4,11.96 90 top
R8  19,45.09 90 top
R9  25.82,45.81 180 top
R10  42.33,46.13 0 top
R11  53.29,46.66 270 top
R12  61.75,37.72 180 top
R13  61.75,32.57 180 top
R14  61.75,36.42 180 top
R15  37.95,7.68 270 top
R16  37.92,5.68 270 top
R17  38.09,3.28 270 top
R18  50.65,10.81 270 top
R19  51.95,8.71 270 top
R20  51.95,6.31 270 top
R21  6.76,50.05 270 top
R22  8.83,50.05 270 top
R23  61.9,54.54 180 top
R24  19,47.02 270 top
R25  25.82,47.11 180 top
R26  42.33,47.43 0 top
R27  54.91,46.66 270 top
R28  36.4,10.11 90 top
R29  38.05,11.96 270 top
R30  38.05,13.81 270 top
R31  38.05,10.11 270 top
TP1  19,7.11 0 top
TP2  55.5,7.11 180 top
TP3  11.93,53.38 0 top
TP4  11.91,50.68 0 top
TP5  69.51,44.49 0 top
TP6  11.91,47.99 0 top
TP8  69.51,47.16 0 top
TP9  58.28,44.17 0 top

### Tracks (layer width: path | path; a pad name or v marks a point on that pad's centre or on a via)
BUZZ  (via drill 0.35)
  Top 0.178: IC3.11 20.51,62.07 arc-90 20.85,62.41 25.36,62.41 arc-45 v25.85,62.21 | R27.2 arc45 R27.2 R11.2 arc45 53.25,46.04 v53.25,45.41 | v52.3,53.76 44.65,58.2 v43.85,59.01
  Bottom 0.178: v25.85,62.21 arc45 27.54,61.51 42.25,61.51 arc-98 42.95,60.71 arc71 v43.85,59.01 | v52.3,53.76 52.79,53.27 arc-45 53.25,52.15 v53.25,45.41
CC1
  Top 0.178: 62.33,36.61 R14.1 65.42,36.42 arc45 J7.A5
CC2
  Top 0.178: 65.93,37.72 J7.B5 arc45 65.84,37.72 R12.1
COM1  (via drill 0.35)
  Top 0.178: IC3.3 20.01,57.84 arc-45 19.75,57.21 arc45 19.65,56.96 v19.65,56.61 | IC4.1 arc-90 18.65,51.56 v18.55,51.56
  Bottom 0.178: v19.65,56.61 19.65,55.91 arc-90 19.15,55.41 18.6,55.41 arc90 18.4,55.21 18.4,51.71 arc90 v18.55,51.56
COM2  (via drill 0.35)
  Top 0.178: IC4.4 v20.61,50.47 arc-90 v20.6,50.46 | v21.8,57.36 21.8,57.81 arc90 IC3.6
  Bottom 0.178: v20.6,50.46 20.6,53.71 arc-90 20.95,54.06 21.8,54.06 arc90 22.2,54.46 22.2,56.26 arc90 22,56.46 arc-90 21.8,56.66 v21.8,57.36
COM3
  Top 0.178: IC3.8 22.85,59.5 arc-90 23.15,59.21 23.15,56.11 arc-90 22.55,55.51 20.4,55.51 arc90 20.11,55.22 IC4.12
EN1  (via drill 0.35)
  Top 0.178: IC3.12 20.01,61.54 arc90 v19.95,61.61 | E1.10 11.6,35.47 arc-45 11.4,35.95 11.4,43.65 arc-45 11.65,44.26 arc-45 v12.49,44.61 13.42,44.61 arc45 14.15,44.91 arc45 14.35,45.39 14.35,49.06 arc45 14.25,49.31 arc-45 14.05,49.79 v14.05,49.81 | v19.25,50.41 arc90 19.61,50.77 IC4.2 | IC4.5 v21.11,49.92 arc-90 v21.1,49.91 | LED2.A arc-45 4.38,45.36 v3.7,45.36
  Bottom 0.178: v19.95,61.61 19.95,60.81 arc90 20.35,60.41 20.55,60.41 arc-90 21.25,59.71 21.25,54.76 arc-90 20.95,54.46 19.3,54.46 arc90 19.1,54.26 19.1,50.56 arc90 v19.25,50.41 arc90 19.05,50.21 19.05,49.86 | v14.05,49.81 v16.85,49.81 19,49.81 arc90 19.05,49.86 | v21.1,49.91 arc-90 20.75,49.56 19.2,49.56 arc-90 19.05,49.71 19.05,49.86 | v3.7,45.36 v3.7,45.35 arc45 5.5,44.61 v12.49,44.61
EN2  (via drill 0.35)
  Top 0.178: IC3.13 arc-90 19.15,60.76 v19.15,61.11 19.15,62.41 arc-90 19.55,62.81 26.65,62.81 arc-90 v26.95,62.51 | LED4.A 59.73,60.59 57.21,58.07 arc-45 56.1,57.61 53.14,57.61 arc-45 v51.45,58.31 | v19.6,54.96 19.35,54.96 arc90 19.25,54.86 19.25,53.87 arc90 IC4.13
  Bottom 0.178: v19.15,61.11 19.15,60.81 arc90 19.95,60.01 20.35,60.01 arc-90 20.85,59.51 20.85,55.31 arc-90 20.5,54.96 v19.6,54.96 | v26.95,62.51 26.95,62.41 arc90 27.45,61.91 45.2,61.91 arc-45 46.99,61.16 47,61.16 arc-45 47.63,59.64 E2.10 50.62,58.65 arc-45 v51.45,58.31
FIRE1  (via drill 0.35)
  Top 0.178: R8.2 R24.2 16.87,46.51 arc45 v16.85,46.51 arc-45 16.59,47.13 16.59,48.98 arc-90 16.92,49.31 19.8,49.31 arc90 20.1,49.61 IC4.3 arc-90 IC4.3 | 6.77,45.59 LED12.A arc45 6.71,45.69 v5.8,46.61
  Bottom 0.178: v16.85,46.51 13.65,46.51 | 13.65,46.51 13.65,49.13 12.23,50.55 arc45 TP4.TP | v5.8,46.61 arc45 6.04,46.51 13.65,46.51
FIRE2  (via drill 0.35)
  Top 0.178: LED13.A 11.53,45.55 arc45 v11.9,45.71 TP6.TP | v24.45,45.81 arc-45 v24.45,45.81 R9.2 R25.2 25.31,47.84 arc90 24.75,48.41 21.75,48.41 arc-90 21.61,48.55 IC4.6
  Bottom 0.178: v24.45,45.81 24.35,45.71 v11.9,45.71
FIRE3  (via drill 0.35)
  Top 0.178: LED14.A arc-45 60.19,59.01 59.05,59.01 arc45 58.54,58.79 57.15,57.41 arc45 56.45,55.71 arc-45 56.02,54.68 | TP8.TP arc-45 69.25,47.78 69.25,50.21 67.49,51.96 arc45 65.7,52.71 59.04,52.71 arc-45 57.35,53.41 56.11,54.65 arc45 56.02,54.68 | R10.2 R26.2 43.4,47.99 arc45 43.45,48.1 v43.45,50.41 | v52.25,53.01 54.35,53.01 56.02,54.68 | v32.2,46.86 arc-45 30.58,47.53 30.4,47.71 arc45 29.43,48.11 26.67,48.11 arc-45 25.95,48.41 arc45 24.82,48.87 v23.3,48.87 | IC4.11 20.61,54.72 arc-90 20.75,54.86 22.75,54.86 arc-90 23,54.61 v23,53.46
  Bottom 0.178: v43.45,50.41 43.45,51.46 | 43.45,51.46 43.45,51.82 arc-90 43.68,52.06 51.3,52.06 v52.25,53.01 | 43.45,51.46 39.85,51.46 arc45 38.05,50.71 36.65,49.31 arc-45 35.44,48.81 34.85,48.81 arc45 33.65,48.31 v32.2,46.86 | v23,53.46 23,49.17 arc90 v23.3,48.87
GND  (via drill 0.35)
  Top 0.178: R4.1 4.89,51.41 v4.85,51.41 | R21.1 v6.75,51.31 | R22.1 8.83,51.31 v8.85,51.31 | IC3.15 20.81,58.95 21.86,58.95 IC3.7 22.45,59 v22.45,58.51 | R8.1 19,43.81 v18.95,43.81 | 28.38,44.31 v28.35,44.31 | IC6.2 28.35,45.26 | C11.1 C10.1 v18.05,61.31 | 16.99,53.61 C13.1 v17.74,54.15 arc-45 v17.75,54.16 | R1.1 58.13,55.97 arc-45 v57.84,56.1 | R23.1 62.41,53.6 arc45 v62.45,53.51 | R18.1 v50.65,12.21 | R19.1 51.95,9.48 arc-45 v52.25,10.21 | R20.1 51.95,6.83 arc-45 v52.25,7.55 | IC9.1 42.3,2.85 | C24.1 v40.55,6.31 | C25.2 v39.25,6.31 | R16.1 38.61,6.19 arc45 v38.65,6.21 | R17.1 39.01,3.79 arc45 v39.05,3.81 | IC2.7 arc-45 32.25,3.15 | C9.1 25.16,7.54 arc-45 v25.15,7.51 | C8.1 26.43,7.45 arc45 v26.45,7.41 | C4.1 20.74,67.38 arc-45 v20.75,67.41 | C5.1 22.41,67.27 arc45 v22.35,67.41 | C7.1 24.05,67.17 arc45 v23.95,67.41 | R10.1 arc-45 41.85,46.07 v41.85,45.31 | R11.1 53.85,47.72 arc-45 v54.05,47.81 | v53.95,48.51 53.1,49.35 arc-45 IC8.2 | R9.1 26.33,44.86 arc45 v26.35,44.81 | C3.2 34.7,50.36 arc45 v34.8,50.41 | R15.1 37.48,8.66 arc45 v37.25,8.76 | R5.1 arc-45 59.5,53.96 v59.75,53.71 | IC4.15 arc90 20.86,52.11 IC4.7 22.01,51.98 arc90 v22.48,51.51 | C12.1 17.89,50.63 arc-45 v17.95,50.61 | R12.2 60.43,37.72 arc45 v60.4,37.71 | R14.2 60.43,36.42 arc45 v60.4,36.41 | C14.1 60.37,35.14 arc-45 v60.35,35.16 | C15.1 60.36,33.86 arc45 v60.35,33.86 | R13.2 arc-45 60.97,32.46 v60.35,32.46
  Top 0.35: C1.2 37.75,61.08 v38.25,60.58 38.62,60.58 arc-45 R3.2 | R3.2 v40.65,60.21 | v40.65,60.21 arc-45 v40.65,60.21 | R3.2 39.53,60.97 arc-45 v39.55,61.01 | R3.2 39.77,59.97 | R3.2 39.77,60.44 arc-45 v40.65,60.81 | v36.85,57.71 arc-45 36.9,57.57 IC1.2 arc45 37.26,55.69 v37.55,55.41 | C2.1 arc45 39.05,54.41 v39.05,55.41 | C17.2 arc-45 40.55,54.6 v40.55,55.41 | C19.2 42.24,54.61 arc-45 v42.55,55.36 | C22.1 40.76,56.12 arc-45 v40.55,56.21 | v36.85,57.71 v36.15,57.71 35.47,57.71 arc-45 v35.45,57.72 | v36.85,57.71 37.36,57.71 arc-45 v37.39,57.7 | IC9.1 v42.3,4.46 | IC9.3 v43.6,4.46 | IC9.5 v44.9,4.46 | IC9.7 v46.2,4.46 | IC2.7 v32.2,4.41 | IC2.5 v30.9,4.46 | IC2.3 v29.6,4.46 | IC2.1 v28.3,4.46
  Top 0.4: 28.38,45.21 IC6.2 v29.35,44.71 | 28.38,45.21 28.38,44.31 | v27.75,44.31 v28.35,44.31 v28.95,44.31 | v27.75,44.31 v27.35,44.71 | v28.95,44.31 v29.35,44.71 | v28.95,44.31 arc45 28.71,44.87 28.38,45.21 | v27.75,44.31 arc-45 27.94,44.77 28.38,45.21 | v27.35,44.71 v29.35,44.71 | v20.76,44.31 v20.75,44.31 v20.15,44.31 | v20.76,44.31 v21.35,44.31 | IC5.2 v20.76,44.31 | v19.75,44.71 v20.15,44.31 | v21.35,44.31 v21.85,44.71 | v20.15,44.31 IC5.2 | v21.35,44.31 IC5.2 | v19.75,44.71 v21.85,44.71 | v19.75,44.71 IC5.2 | v21.85,44.71 IC5.2 | v27.35,44.71 28.38,45.21 | 38.5,48.51 v37.85,48.51 | v37.85,48.51 IC7.2 | v37.45,48.01 v37.85,48.51 | v37.45,48.01 IC7.2 | IC7.2 v38.55,48.51 v39.15,48.51 | v37.45,48.01 v39.15,48.51 | v39.15,48.51 IC7.2 | v39.55,48.01 v39.15,48.51 | v39.55,48.01 IC7.2 | v37.45,48.01 v39.55,48.01 | 61.21,32.7 arc-45 R13.2 | C23.2 39.05,48.75 arc45 v39.15,48.51
  Top 0.48: C2.1 C17.2 41.25,54.38 | 41.25,54.38 42.14,54.38 arc45 C19.2 | C23.2 C16.2 C18.2 | C21.1 C6.1 | C22.1 41.57,55.15 arc-45 41.25,54.38 | C20.1 45.91,56.22 arc-45 v45.95,56.21
  Top 0.5: C6.1 arc-45 45.7,52.96 v46.45,52.96
  Top 0.6: J7.B12 v67.8,34.41 | J7.A12 v67.45,39.91
  Bottom 0.4: v21.35,44.31 21.35,45.11 20.75,45.11
  pour Bottom: -1.75,36.21 -1.75,75.21 -0.75,75.21 76.25,75.21 76.25,5.21 76.25,-1.79 13.25,-1.79 -1.75,-1.79
INVR1  (via drill 0.35)
  Top 0.152: 33.87,7.41 LED6.A
  Top 0.178: IC2.12 29.6,8.16 v30.25,7.51 29.25,6.51 25.25,6.51 arc-67 22.85,8.11 arc8 22.65,8.51 arc-14 21.75,10.81 arc-17 21.07,17.38 arc33 20.51,19.64 16.15,27.14 arc-30 15.22,30.61 15.22,33.95 15.23,33.96 15.23,34.08 15.23,34.21 arc0 15.25,36.6 15.25,37.91 15.31,56.21 15.31,56.34 arc90 14.95,56.71 arc-90 14.55,57.11 v14.55,59.01 | v32.85,7.41 33.87,7.41 | v17.65,58.81 18.91,58.81 arc90 IC3.1
  Bottom 0.152: v30.25,7.51 30.35,7.41
  Bottom 0.178: 30.35,7.41 v32.85,7.41 | v14.55,59.01 17.45,59.01 arc-90 v17.65,58.81
INVR2  (via drill 0.35)
  Top 0.152: 30.9,5.96 30.95,5.91
  Top 0.178: IC2.10 30.9,5.96 | LED7.A 31.32,5.54 30.95,5.91 30.88,5.91 30.58,6.2 25.25,6.2 arc-67 22.57,7.99 arc9 22.38,8.36 arc-14 21.45,10.73 arc-17 20.76,17.39 arc33 20.24,19.48 15.88,26.98 arc-30 14.91,30.61 14.91,34.07 14.92,34.08 14.92,34.2 14.93,34.21 14.94,36.61 14.94,37.91 15,55.81 15,55.95 arc90 14.65,56.31 arc-90 14.15,56.81 14.15,58.61 arc-90 v13.75,59.01 | IC3.4 20.51,57.04 arc-90 v20.38,56.91
  Bottom 0.178: v20.38,56.91 20.38,59.27 arc90 20.15,59.51 14.25,59.51 arc90 v13.75,59.01
INVR3  (via drill 0.35)
  Top 0.152: 32.2,6.16 v32.25,6.11
  Top 0.178: IC2.8 32.2,6.16 | LED8.A 33.97,3.68 v32.75,4.91 31.45,4.91 30.46,5.9 25.25,5.9 arc-67 22.28,7.87 arc1 22.1,8.21 arc-14 21.15,10.65 arc-17 20.45,17.41 arc33 19.98,19.32 15.61,26.83 arc-30 14.6,30.61 14.6,34.19 14.62,34.21 14.63,36.61 14.63,37.91 14.69,55.2 14.69,55.56 arc90 14.35,55.91 arc-90 13.25,57.01 13.25,59.41 arc-90 13.75,59.91 14.65,59.91 arc90 14.75,60.01 14.75,62.61 arc-90 15.05,62.91 v18.45,62.91 | IC3.9 arc90 21.68,60.57 v21.68,61.61
  Bottom 0.152: 32.25,5.41 v32.75,4.91
  Bottom 0.178: v32.25,6.11 32.25,5.41 | v21.68,61.61 arc-90 21.65,61.63 21.65,62.31 arc90 21.35,62.61 18.75,62.61 arc-90 v18.45,62.91
N$1
  Top 0.178: R1.2 61.09,56.06 arc45 LED1.C
N$2
  Top 0.178: C3.1 33.91,53.59 arc-45 34.15,54.17
  Top 0.8: 35.28,55.87 IC1.1 35.95,54.49 D1.2 35.28,55.16 35.28,55.87 | 35.28,55.87 34.15,54.74 34.15,54.17
  Top 2: D1.2 34.15,54.17 30.76,54.17 arc45 L1.1
N$3
  Top 0.178: R3.1 39.53,57.59 arc-90 R2.2 arc90 39.49,57.61 38.15,57.61 arc90 37.85,57.31 IC1.3
N$4  (via drill 0.35)
  Top 0.178: v62.15,60.01 62.3,59.85 arc45 LED4.C | R5.2 arc-45 57.97,54.73 57.35,55.36 57.35,56.29 arc-45 v57.75,57.26
  Bottom 0.178: v62.15,60.01 61.8,60.01 arc45 60,59.26 arc45 59.92,59.23 arc45 59.58,59.08 v57.75,57.26
N$5
  Top 0.178: LED2.C 4.86,49.51 arc-45 R4.2
N$8
  Top 0.178: R18.2 50.65,10.07 arc-45 LED9.C
N$9
  Top 0.178: R19.2 51.13,7.38 arc-45 50.95,7.31 arc45 50.69,7.2 LED10.C
N$10
  Top 0.178: R20.2 arc-45 51.74,5.3 51.45,5.01 arc-45 50.24,4.51 LED11.C
N$11
  Top 0.178: LED12.C 6.77,49.52 arc45 R21.2
N$12
  Top 0.178: LED13.C 8.8,49.46 arc-45 R22.2
N$13  (via drill 0.35)
  Top 0.178: R23.2 61.39,53.61 arc-45 v61.35,53.51 | v61.25,58.51 61.44,58.32 arc45 LED14.C
  Bottom 0.178: v61.35,53.51 61.35,58.26 arc45 v61.25,58.51
N$14
  Top 1.2: J5.2 IC7.3
N$15
  Top 1.2: J4.2 30.63,46.16 arc-90 IC6.3
N$16
  Top 0.178: IC9.13 42.95,10.31 41.55,11.71 J2.4 arc45 40.99,11.6 40.05,10.66 arc-45 39.94,10.61 R31.1
N$17
  Top 1.2: J3.2 23.01,46.16 arc-90 IC5.3
N$18
  Top 0.178: LED7.C 36.15,5.54 arc-45 36.95,5.21 arc45 37.02,5.17 R16.2
N$19
  Top 0.178: IC9.11 44.25,10.71 J2.3 42.94,12.01 arc45 41.15,12.76 38.72,12.76 arc45 38.6,12.71 38.57,12.68 arc-45 R29.1
N$20
  Top 0.178: R24.1 arc90 19.12,47.41 20.51,47.41 arc-90 IC5.1
N$21
  Top 0.178: R25.1 28.33,47.11 arc90 IC6.1
N$22
  Top 0.5: IC8.3 56.59,48.88 arc-45 56.81,48.36 LS1.2
N$23
  Top 0.178: LED8.C 36.65,2.89 arc45 36.85,2.81 38.01,2.81 arc-45 R17.2
N$24
  Top 0.178: R26.1 arc-45 41.65,47.36 IC7.1
N$25
  Top 0.178: R27.1 54.91,48.4 arc45 54.5,49.41 53.09,50.81 arc-45 IC8.1
N$26
  Top 0.178: IC9.9 45.55,11.41 J2.2 44.59,12.36 arc45 42.8,13.11 40.15,13.11 arc-45 38.95,13.61 38.38,14.18 arc45 R30.1
N$27
  Top 0.178: LED6.C arc45 36.87,7.17 R15.2
PICKLE1  (via drill 0.35, 0.45)
  Top 0.152: 47.55,8.51 LED9.A
  Top 0.178: IC9.12 43.6,8.06 v44.05,7.61 | v46.65,7.61 47.55,8.51 | IC3.2 18.64,58.1 arc90 18.64,58.11 16.55,58.11 arc90 16.25,57.81 16.25,57.21 arc90 16.24,57.2 16.24,36.67 16.17,36.6 arc-1 16.15,34.21 16.15,30.61 16.14,30.6 arc30 16.95,27.61 21.25,20.21 v24.25,16.91
  Bottom 0.178: v46.65,7.61 v44.05,7.61 40.05,7.61 arc-32 35.85,8.81 arc-45 35.42,9.84 35.42,12.15 arc45 35.18,12.71 34.13,13.76 arc45 33.23,14.14 27.69,14.14 arc-45 25.89,14.88 24.44,16.34 arc-45 24.29,16.7 24.29,16.86 arc45 24.28,16.87 v24.25,16.91
PICKLE2  (via drill 0.35, 0.45)
  Top 0.178: IC9.10 44.9,7.06 45.45,6.51 | 45.45,6.51 LED10.A | 45.45,6.51 44.53,6.51 arc-45 v44.05,6.71 | v18.05,56.11 20.65,56.11 arc90 21.01,56.47 IC3.5 | v22.65,17.51 arc6 21.85,18.81 21.09,19.9 20.98,20.05 16.68,27.45 arc-30 15.83,30.61 15.84,30.61 15.84,30.73 15.84,34.21 15.86,36.6 15.87,37.9 15.93,56.2 15.93,57.42 v15.75,57.61
  Bottom 0.178: v44.05,6.71 42.83,6.71 arc-45 42.35,6.91 arc45 41.62,7.21 40.05,7.21 arc-32 35.64,8.47 arc-45 35.02,9.96 35.02,12.15 arc45 34.9,12.43 33.85,13.48 arc45 33.23,13.74 27.69,13.74 arc-45 25.61,14.6 22.74,17.47 arc45 v22.65,17.51 | v15.75,57.61 16.25,57.61 arc-90 17.15,56.71 arc90 17.75,56.11 v18.05,56.11
PICKLE3  (via drill 0.35, 0.45)
  Top 0.178: IC9.8 46.2,8.06 45.95,7.81 v45.95,7.11 | v45.95,5.71 47.15,4.51 LED11.A | v21.05,61.41 21.05,60.44 arc-90 IC3.10 | v17.75,62.21 15.45,62.21 arc90 15.15,61.91 15.15,57.21 arc90 15.35,57.01 arc-90 15.62,56.73 15.62,56.2 15.56,37.9 15.55,36.6 arc0 15.54,34.21 15.54,30.86 15.53,30.85 15.53,30.61 15.53,30.61 arc30 16.41,27.29 20.72,19.9 21.35,18.91 arc-37 21.92,16.61 arc46 v21.95,16.46
  Bottom 0.178: v45.95,7.11 v45.95,5.71 43.57,5.71 arc-45 42.85,6.01 42.79,6.06 arc45 41,6.81 40.05,6.81 arc-32 35.42,8.13 arc-45 34.62,10.08 34.62,12.15 33.57,13.2 arc45 33.23,13.34 27.69,13.34 arc-45 25.33,14.31 23.63,16.01 arc45 22.8,16.36 22.19,16.36 arc-45 v21.95,16.46 | v21.05,61.41 21.05,62.01 arc90 20.85,62.21 v17.75,62.21
RAVEN1
  Top 0.178: IC2.13 28.95,10.21 27.45,11.71 | 27.45,11.71 J1.4 | R6.2 35.68,14.31 arc45 34.1,13.66 arc-45 33.01,13.21 30,13.21 arc45 28.2,12.46 27.45,11.71
RAVEN2
  Top 0.178: IC2.11 30.25,10.71 J1.3 29.99,12.45 arc-45 30.85,12.81 35.26,12.81 arc-45 35.5,12.71 arc45 36.08,12.46 R7.2
RAVEN3
  Top 0.178: J1.2 31.55,11.41 31.55,10.56 | IC2.9 31.55,10.56 | R28.2 arc-45 36.26,10.56 31.55,10.56
SHLD
  Top 0.178: J7.MH2 J7.MH4 J7.MH3 J7.MH1 arc-45 65.42,32.57 R13.1 arc-45 62.21,32.59
VBAT  (via drill 0.35)
  Top 0.178: C11.2 arc-45 15.88,60.34 C10.2
  Top 0.4: TP3.TP 11.93,53.63 arc-45 12.67,55.43 v13.05,55.81
  Top 1: v28.9,58.16 L1.2 | v29.75,58.16 L1.2 | v30.48,58.16 L1.2 | v31.25,58.16 L1.2 | v32.05,58.16 L1.2
  Bottom 0.35: v28.9,58.16 28.9,57.71 | 28.9,57.71 v28.9,57.16 | v29.75,58.16 v29.75,57.11 | v32.05,58.16 32.05,57.61 | 32.05,57.61 32.05,57.21 | 32.05,57.21 v32.05,57.11 | v31.25,58.16 v31.25,57.11 | v30.48,58.16 30.48,57.11 v30.45,57.11 | v30.45,57.11 v29.75,57.11 | v30.45,57.11 v31.25,57.11 | v31.25,57.11 v32.05,57.11 | v32.05,58.16 v31.25,58.16 | v31.25,58.16 v30.48,58.16 | v30.48,58.16 v29.75,58.16 | v29.75,58.16 v28.9,58.16 | v28.9,58.16 v30.45,57.11 | v28.9,57.16 v30.48,58.16 | v29.75,58.16 v31.25,57.11 | v29.75,57.11 v31.25,58.16 | v30.48,58.16 v32.05,57.11 | v30.45,57.11 v32.05,58.16 | 32.05,57.21 29.32,57.64 | 29.32,57.64 28.9,57.71 | 29.32,57.64 32.05,57.61 | v29.75,58.16 v28.9,57.16 | v28.9,57.16 v29.75,57.11 | v29.75,57.11 v28.9,58.16 | v31.25,57.11 v32.05,58.16 | v31.25,58.16 v32.05,57.11
  Bottom 0.4: v13.05,55.81 v15.75,58.51
  Bottom 0.5: TP3.TP 12.61,54.06 arc-45 14.41,54.81 v17.25,54.81
  pour Top: -3.75,37.21 -3.75,-3.79 6.25,-3.79 78.25,-3.79 78.25,0.21 78.25,77.21 77.25,77.21 -3.75,77.21 -3.75,73.21
VBUS
  Top 0.178: 62.19,33.9 arc-45 C15.2 C14.2 64.8,35.14 arc45 J7.B9 65.96,35.61
  Top 0.8: J7.B9 67.55,35.64 67.55,38.68 J7.A9
  Top 1: J7.A9 65.53,38.68 arc-45 64.25,39.21 arc45 63.5,39.52 D2.A
VDEP  (via drill 0.35)
  Top 0.178: 40.25,52.83 C17.1 | C17.1 40.64,51.53 arc90 C16.1 | C16.1 40.25,51.48 39.25,51.48 C23.1 39.05,52.82 arc90 C2.2 38.11,52.83 arc45 v38.05,52.81 | C17.1 arc-45 40.74,52.87 C19.1 arc-45 42.25,52.85 | C18.1 C16.1 | R2.1 arc-45 39.15,56.41 v38.75,56.41
  Top 0.48: C2.2 40.25,52.83 | C17.1 42.14,52.83 arc45 C19.1 arc-45 42.25,52.85 C18.1 40.25,51.48 | C16.1 39.25,51.48 | D1.1 36.94,50.74 arc-45 38.74,51.48 C23.1
  Top 0.5: C18.1 44.19,51.48 arc45 v44.25,51.51 | v66.25,44.21 arc45 66.71,45.32 LS1.1
  Top 1.2: J5.1 36.25,50.04 arc-90 D1.1
  Bottom 0.178: v38.75,56.41 38.45,56.41 arc45 38.05,55.44 v38.05,52.81
  Bottom 0.5: v44.25,51.51 51.66,51.51 arc-45 52.15,51.31 arc-45 52.35,50.82 52.35,45.11 52.56,44.89 arc45 53.25,44.61 57.24,44.61 arc-45 TP9.TP arc-45 58.36,44.21 v66.25,44.21
  Bottom 1.2: J3.1 21.01,41.35 arc90 22.15,40.21 29.25,40.21 | 29.25,40.21 35.1,40.21 arc-90 35.15,40.16 arc90 36.25,41.26 J5.1 | J4.1 28.63,40.83 arc90 29.25,40.21

### Text on the board
tPlace: Live | VCC | OR | VBAT | GND | On | VBAT | C3 Enable | VCC | OUT | Boost | AND | F1 | GND | MOSFETs | F3 | F2 | Buzzer | Live | 12V | + | + | VBAT | VBUS | USB C | BAT1 | BAT2 | WARNING: / Check Polarity | C1/C2 Enable | C1 | C2 | C3 | USB POW | JLCJLCJLCJLC | C1/C2/C3/GND | C1/C2/C3/GND | C1 | Pickle Activity | C1 | C2 | VCC | C2 | GND | INV | INV | C3 | C3 | Raven Activity
bPlace: ART 2024 | Frej Dunn Shreya Ramteke | Sharwa Molla Hrithik Parmessur | Shrey Bohra Rohit Singh / Charlie Aveline Nihal Simha | Benedek Barna Simeon Charles | Alice Martin Krishna Chivukula | Camillo De Gregorio Nehir Gerek | Abhik Chatterjee Selim Gaddas | Charlie Petersen Zachary Sun | Pranay Saini Christopher Simpson | Akshat Tripathi | Rui Cheng Yeu Zak Leek Demetrios Economou | VBAT | C3 Enable | F1 | ART Avionics | F3 | F2 | 12V | C1 | C2 | C3 | BAT1 | BAT2 | VBAT | + | + | WARNING: / Check Polarity | C1/C2 Enable | Raven Input | Pickle Input | GND/C3/C2/C1 | GND/C3/C2/C1 | Lockie | GND | VCC | Designed by Shrey Bohra
tNames: C:/Users/shrey/Downloads/siriusA-mono.bmp